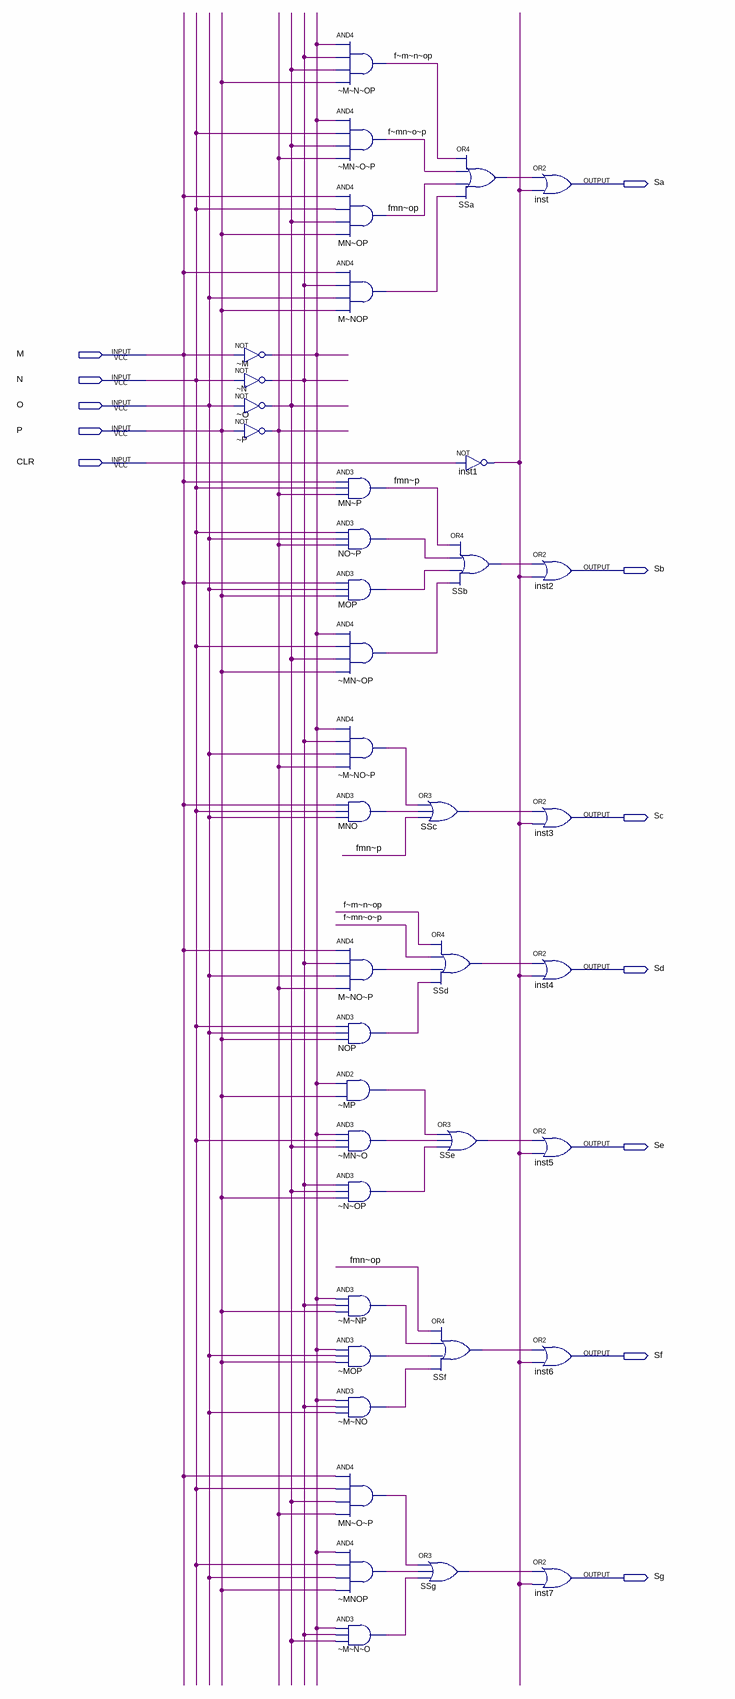
[diagram p0: schematic sheet]
// Quartus schematic HEX_TO_7SEG_DECODER.bdf as structural Verilog: 40 symbols, 12 pins
module HEX_TO_7SEG_DECODER (
  input  M,
  input  N,
  input  O,
  input  P,
  input  CLR,
  output Sa,
  output Sb,
  output Sc,
  output Sd,
  output Se,
  output Sf,
  output Sg
);

  wire _M_N_O_out, _M_NO_out, _M_NO_P_out, _M_NP_out, _M_out, _MN_O_out, _MN_OP_out, _MNOP_out, _MOP_out,
       _MP_out, _N_OP_out, _N_out, _O_out, _P_out, \fmn~op , \fmn~p , \f~mn~o~p , \f~m~n~op , inst1_out,
       M_NO_P_out, M_NOP_out, MN_O_P_out, MNO_out, MOP_out, NO_P_out, NOP_out, SSa_out, SSb_out, SSc_out,
       SSd_out, SSe_out, SSf_out, SSg_out;

  not \u_~M  (_M_out, M);
  not \u_~N  (_N_out, N);
  not \u_~O  (_O_out, O);
  not \u_~P  (_P_out, P);
  and \u_~M~N~OP  (\f~m~n~op , _M_out, _N_out, _O_out, P);
  and \u_~MN~O~P  (\f~mn~o~p , _M_out, N, _O_out, _P_out);
  and \MN~OP  (\fmn~op , M, N, _O_out, P);
  and \M~NOP  (M_NOP_out, M, _N_out, O, P);
  and \MN~P  (\fmn~p , M, N, _P_out);
  and \NO~P  (NO_P_out, N, O, _P_out);
  and MOP (MOP_out, M, O, P);
  and \u_~MN~OP  (_MN_OP_out, _M_out, N, _O_out, P);
  and \u_~M~NO~P  (_M_NO_P_out, _M_out, _N_out, O, _P_out);
  and MNO (MNO_out, M, N, O);
  and \M~NO~P  (M_NO_P_out, M, _N_out, O, _P_out);
  and NOP (NOP_out, N, O, P);
  and \u_~MP  (_MP_out, _M_out, P);
  and \u_~MN~O  (_MN_O_out, _M_out, N, _O_out);
  and \u_~N~OP  (_N_OP_out, _N_out, _O_out, P);
  and \u_~M~NP  (_M_NP_out, _M_out, _N_out, P);
  and \u_~MOP  (_MOP_out, _M_out, O, P);
  and \u_~M~NO  (_M_NO_out, _M_out, _N_out, O);
  and \MN~O~P  (MN_O_P_out, M, N, _O_out, _P_out);
  and \u_~MNOP  (_MNOP_out, _M_out, N, O, P);
  and \u_~M~N~O  (_M_N_O_out, _M_out, _N_out, _O_out);
  or SSc (SSc_out, _M_NO_P_out, MNO_out, \fmn~p );
  or SSg (SSg_out, MN_O_P_out, _MNOP_out, _M_N_O_out);
  or SSa (SSa_out, \f~m~n~op , \f~mn~o~p , \fmn~op , M_NOP_out);
  not inst1 (inst1_out, CLR);
  or SSb (SSb_out, \fmn~p , NO_P_out, MOP_out, _MN_OP_out);
  or SSd (SSd_out, \f~m~n~op , \f~mn~o~p , M_NO_P_out, NOP_out);
  or SSe (SSe_out, _MP_out, _MN_O_out, _N_OP_out);
  or SSf (SSf_out, \fmn~op , _M_NP_out, _MOP_out, _M_NO_out);
  or inst (Sa, SSa_out, inst1_out);
  or inst2 (Sb, SSb_out, inst1_out);
  or inst3 (Sc, SSc_out, inst1_out);
  or inst4 (Sd, SSd_out, inst1_out);
  or inst5 (Se, SSe_out, inst1_out);
  or inst6 (Sf, SSf_out, inst1_out);
  or inst7 (Sg, SSg_out, inst1_out);
endmodule
